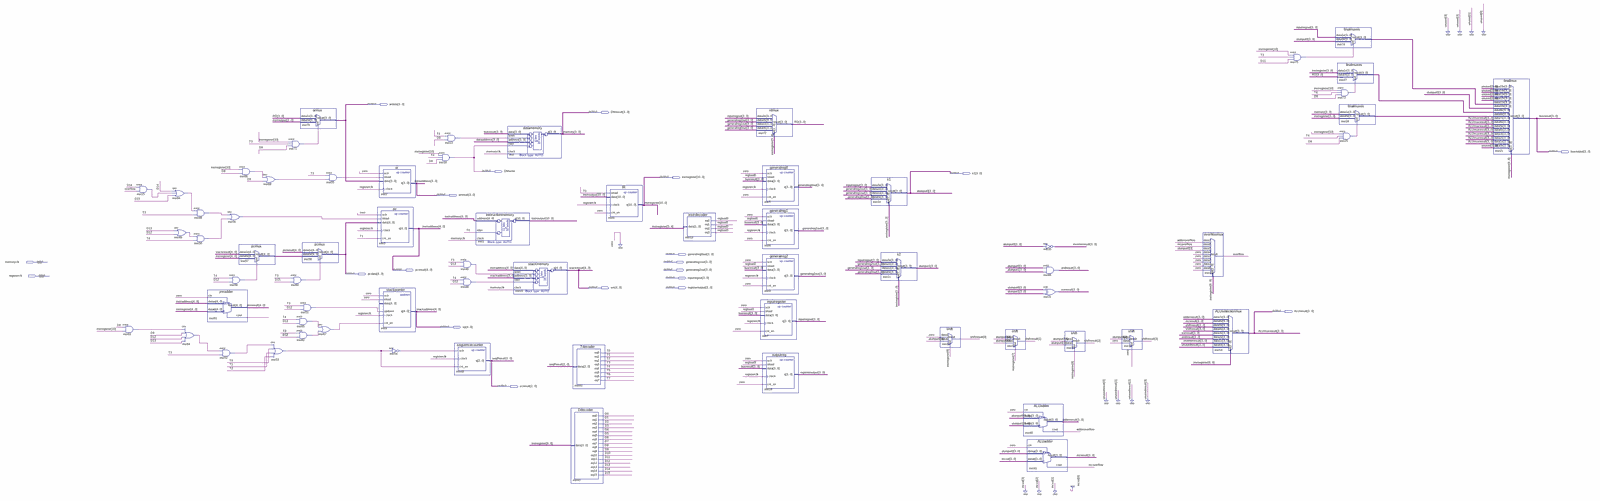
[diagram p0: schematic sheet, whole]
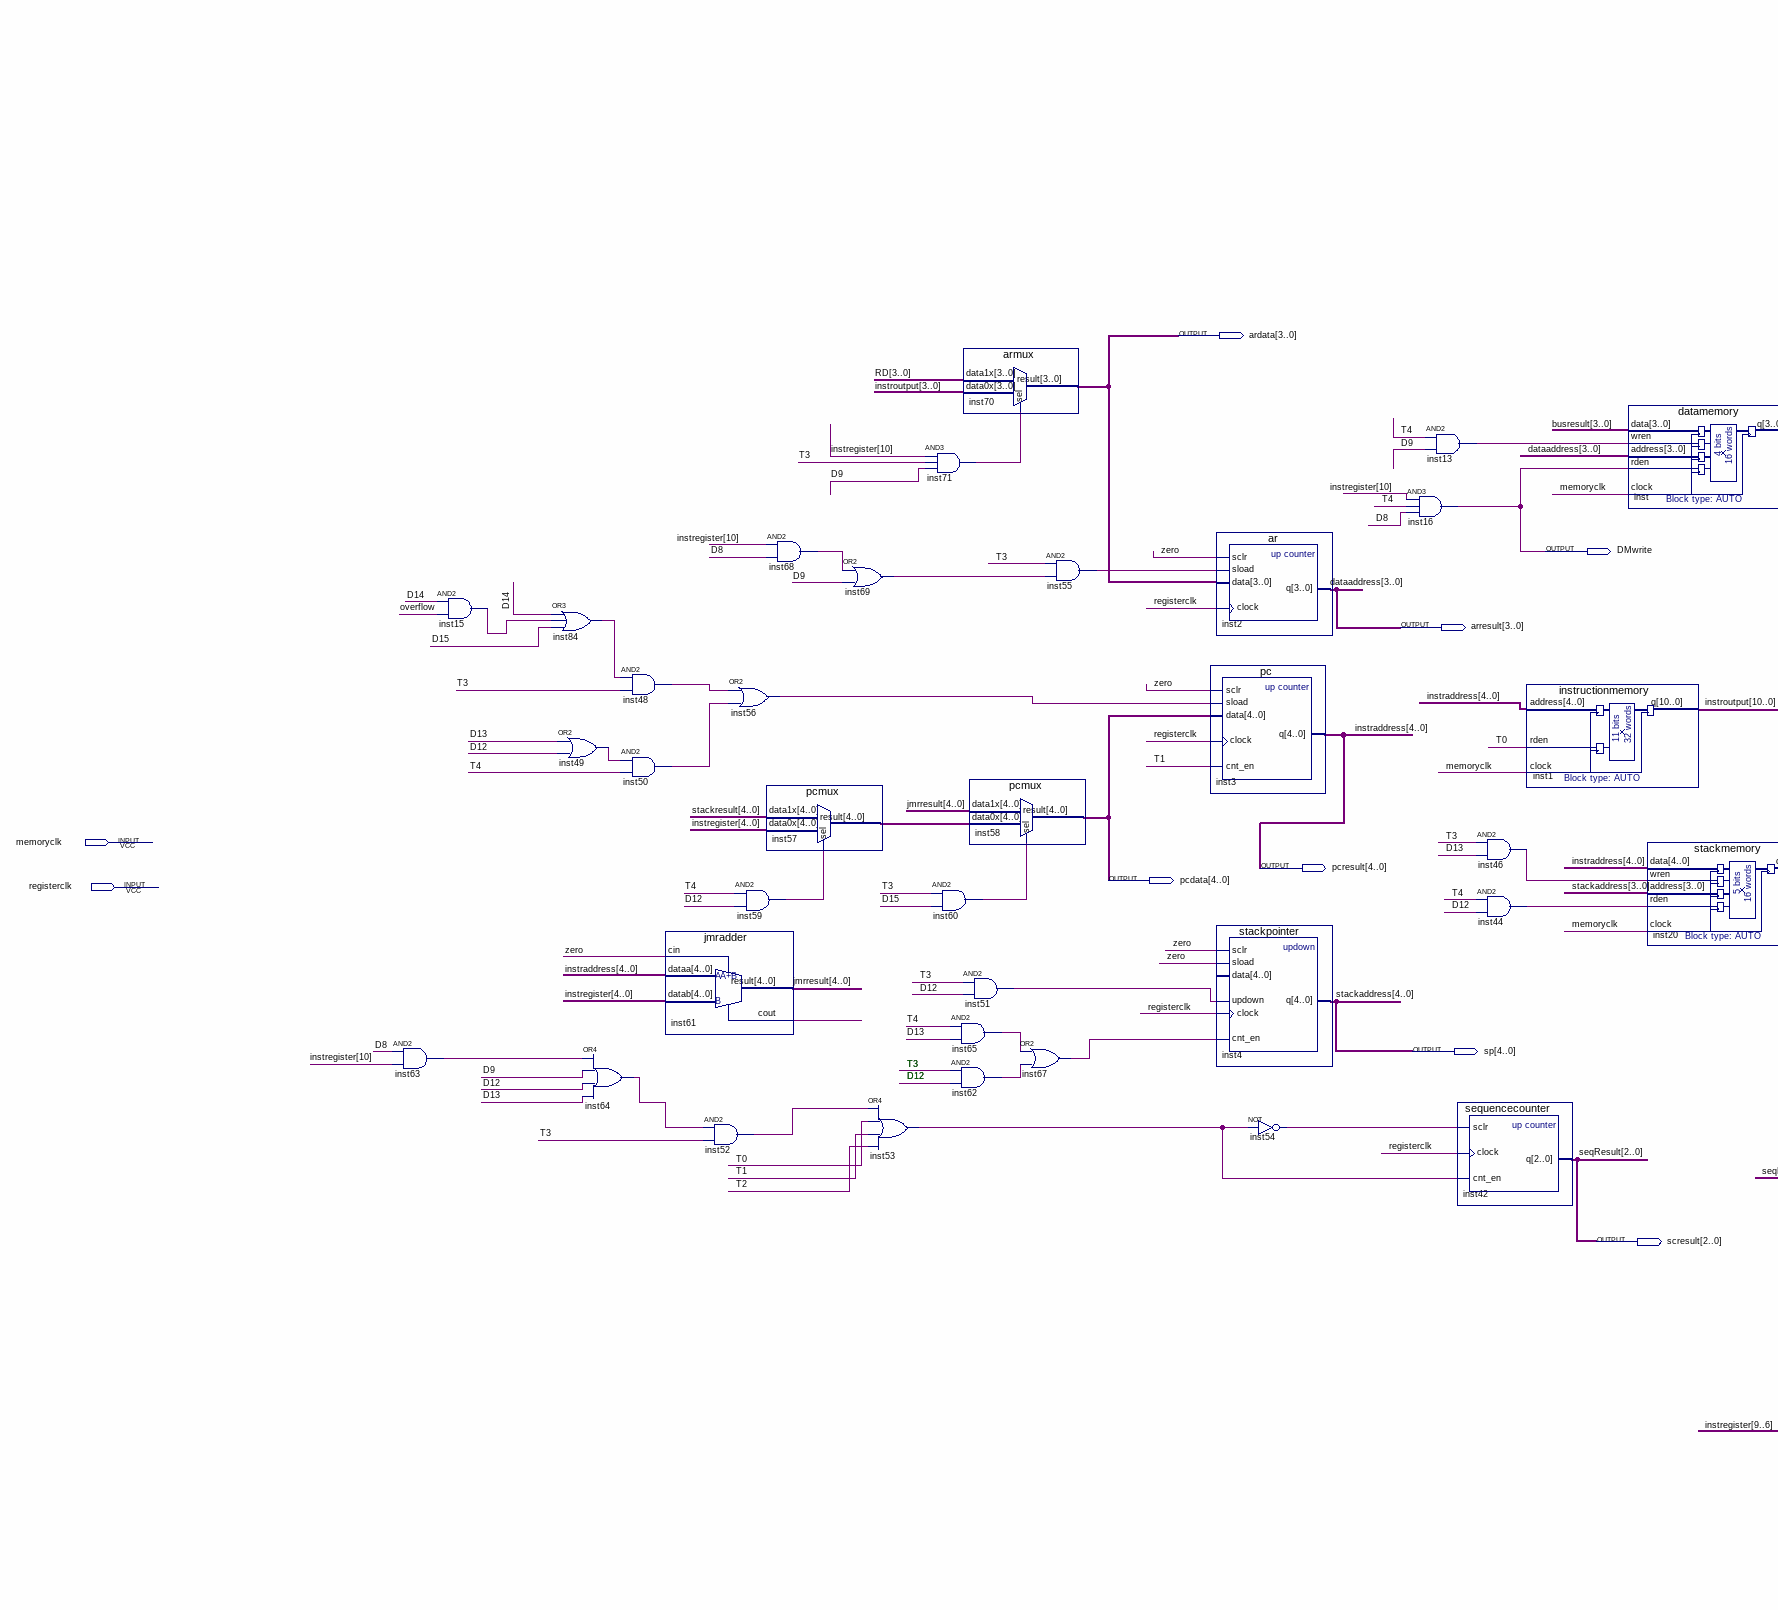
[diagram p1: schematic sheet, left part]
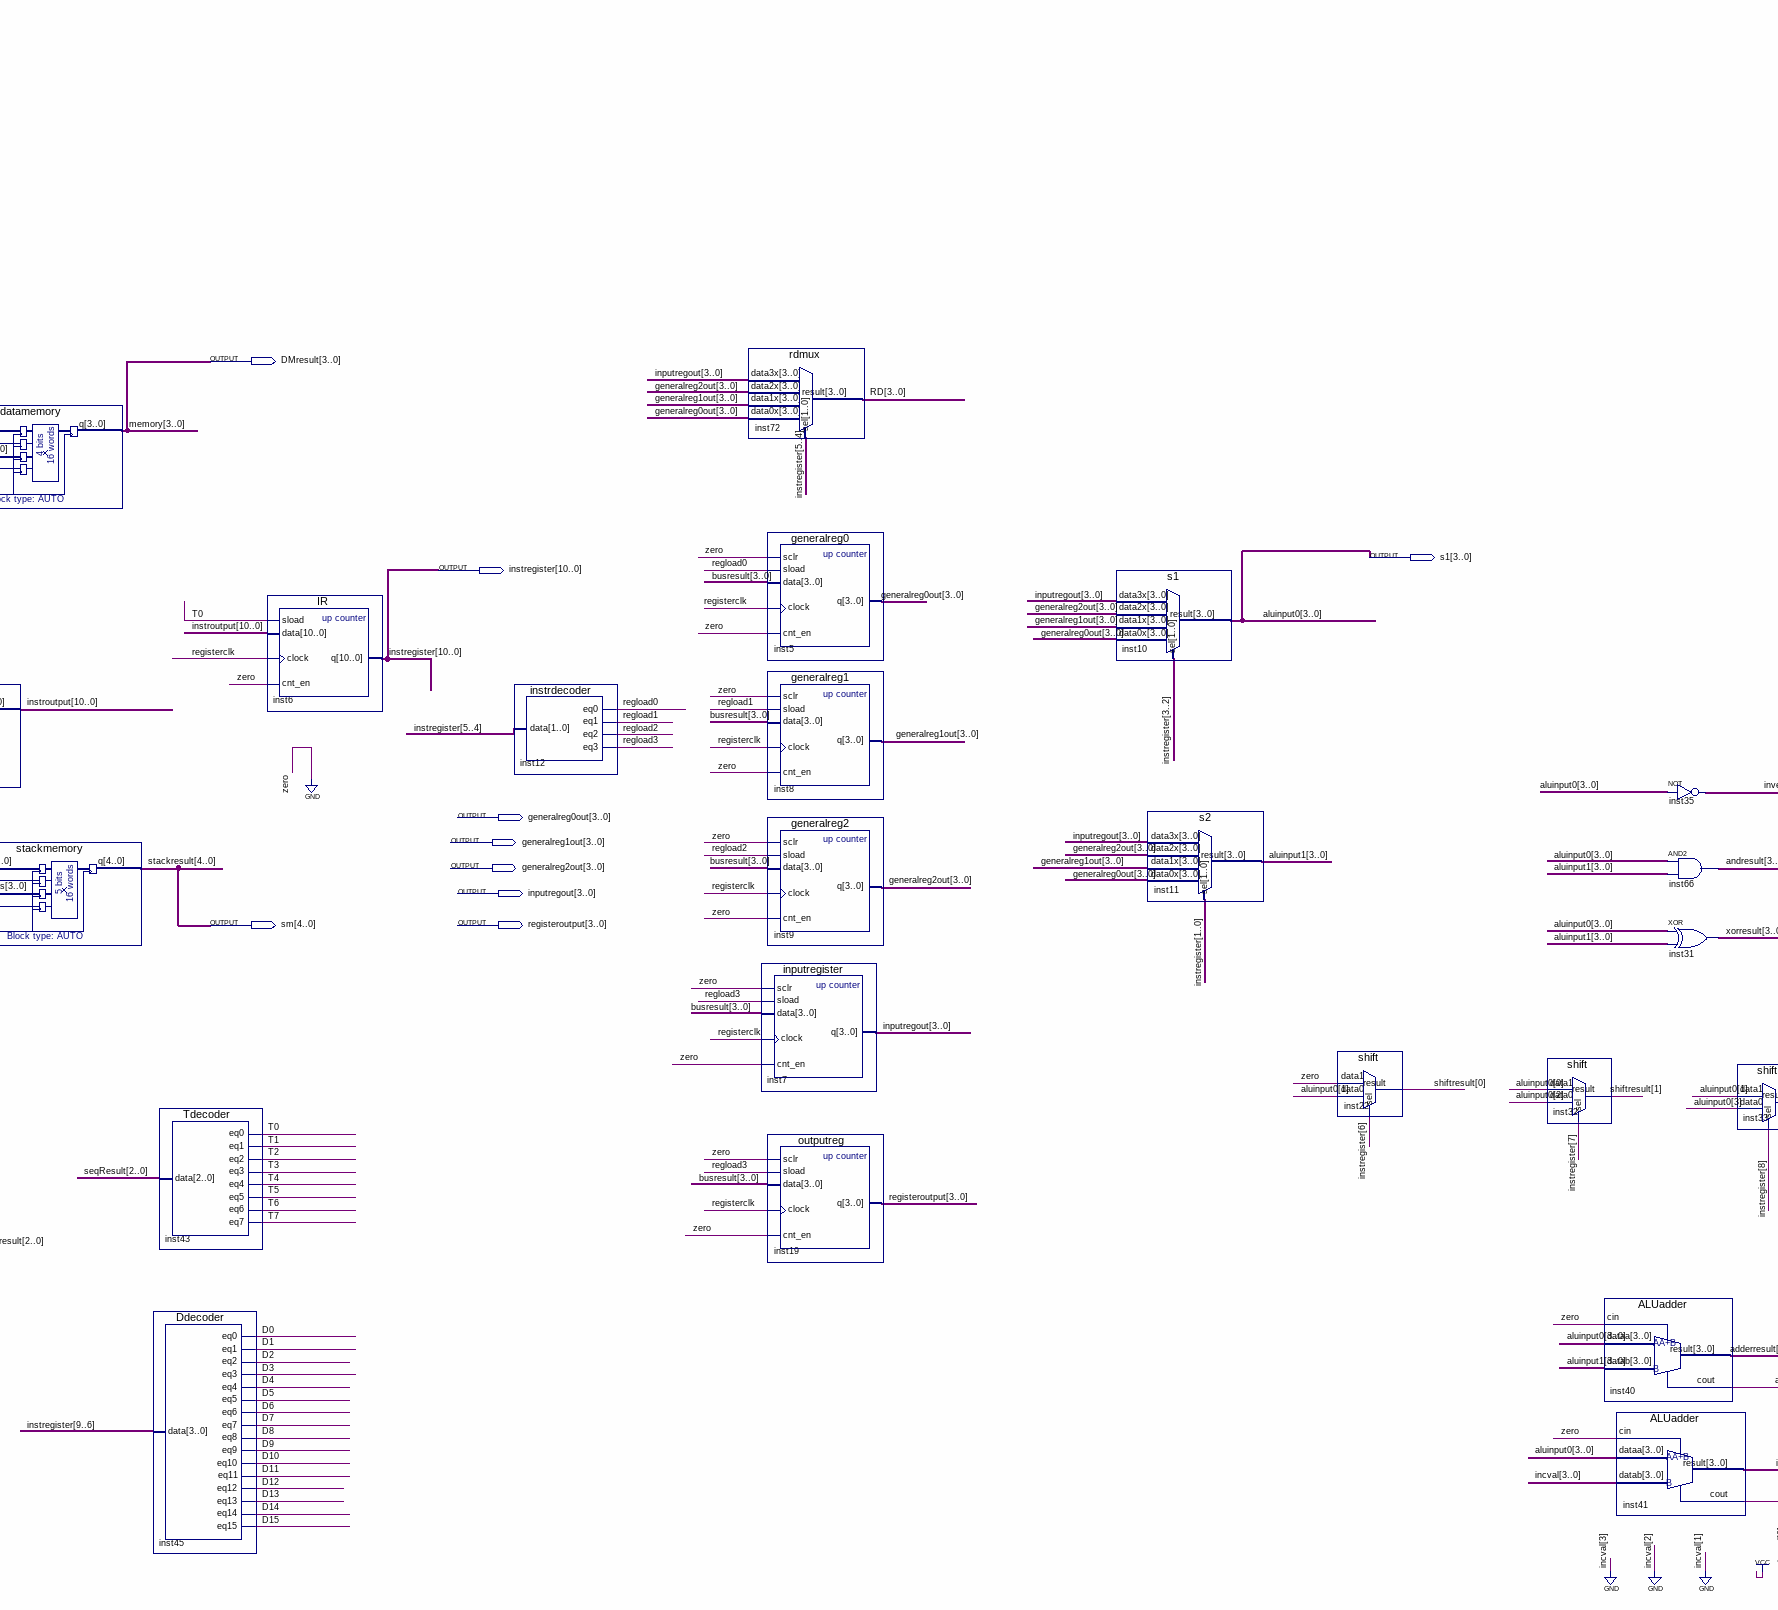
[diagram p2: schematic sheet, centre part]
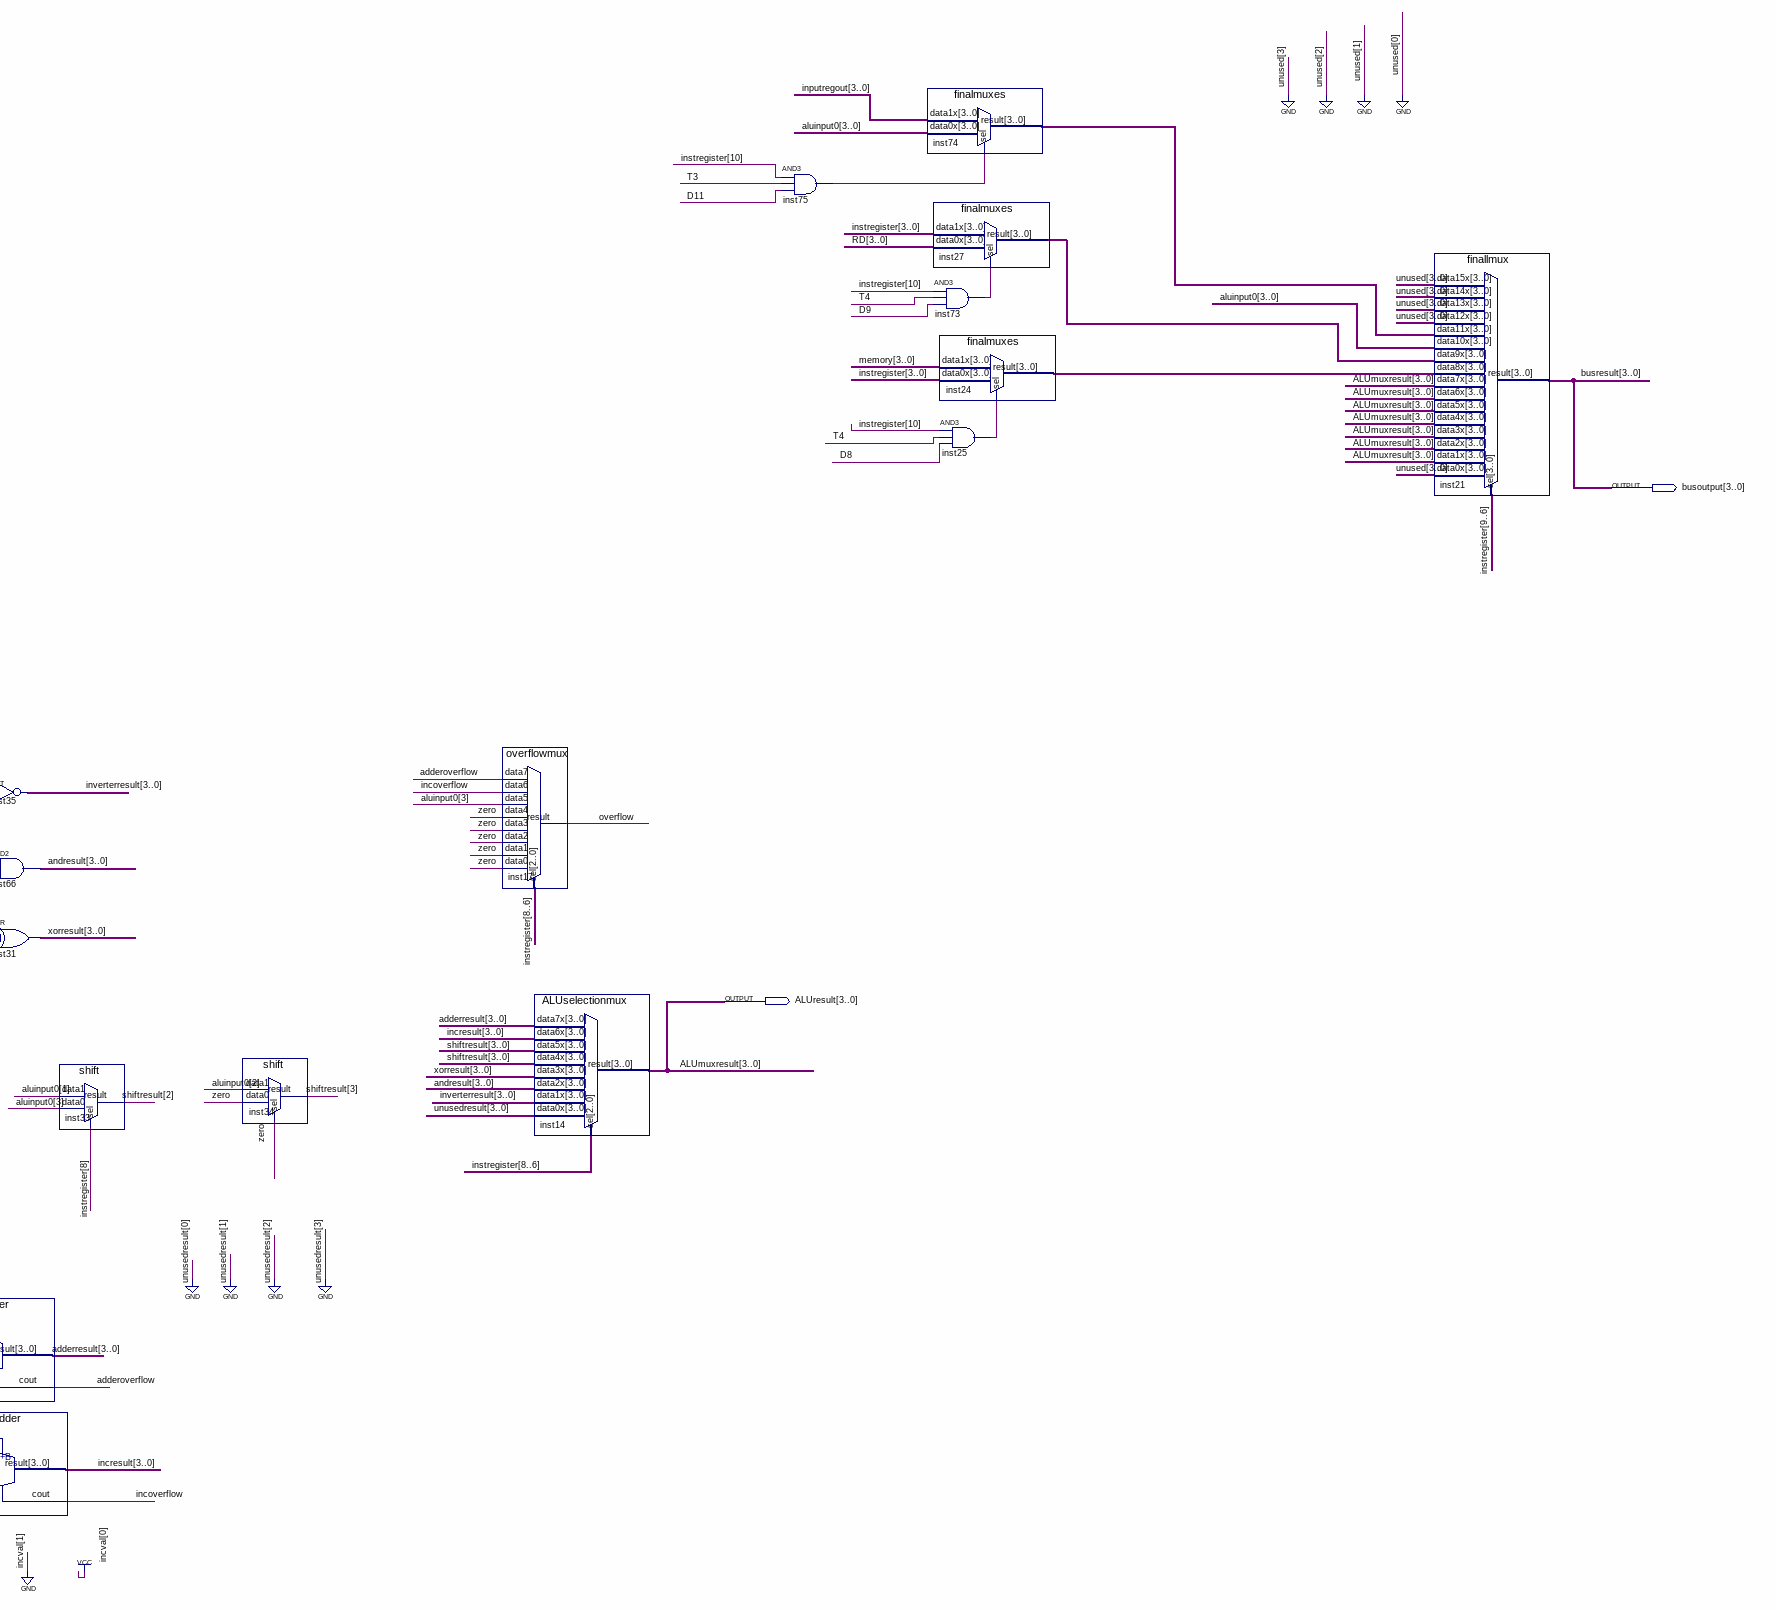
[diagram p3: schematic sheet, right part]
// Quartus schematic group32_hw8.bdf as structural Verilog: 66 symbols, 20 pins
module group32_hw8 (
  input  memoryclk,
  input  registerclk,
  output [3:0] ardata,
  output [3:0] DMresult,
  output [3:0] busoutput,
  output DMwrite,
  output [3:0] s1,
  output [10:0] instregister,
  output [3:0] arresult,
  output [3:0] generalreg0out,
  output [3:0] generalreg1out,
  output [4:0] pcresult,
  output [3:0] generalreg2out,
  output [4:0] pcdata,
  output [3:0] inputregout,
  output [4:0] sm,
  output [3:0] registeroutput,
  output [3:0] ALUresult,
  output [4:0] sp,
  output [2:0] scresult
);

  wire adderoverflow, D0, D1, D2, D3, D4, D5, D6, D7, D8, D9, D10, D11, D12, D13, D14, D15, incoverflow,
       inst13_out, inst15_out, inst25_out, inst44_out, inst46_out, inst48_out, inst49_out, inst50_out,
       inst51_out, inst52_out, inst53_out, inst54_out, inst55_out, inst56_out, inst59_out, inst60_out,
       inst61_cout, inst62_out, inst63_out, inst64_out, inst65_out, inst67_out, inst68_out, inst69_out,
       inst71_out, inst73_out, inst75_out, inst84_out, overflow, regload0, regload1, regload2, regload3, T0,
       T1, T2, T3, T4, T5, T6, T7;
  wire [3:0] adderresult, aluinput1, andresult, incresult, inst24_result, inst27_result, inst74_result,
       inverterresult, RD, shiftresult, xorresult;
  wire [4:0] inst57_result, jmrresult;
  wire [10:0] instroutput;

  and inst63 (inst63_out, D8, instregister[10]);
  and inst15 (inst15_out, D14, overflow);
  or inst84 (inst84_out, D14, inst15_out, D15);
  or inst49 (inst49_out, D13, D12);
  or inst64 (inst64_out, inst63_out, D9, D12, D13);
  and inst48 (inst48_out, inst84_out, T3);
  and inst50 (inst50_out, inst49_out, T4);
  jmradder inst61 (.cin(1'b0), .dataa(pcresult), .datab(instregister[4:0]), .result(jmrresult), .cout(inst61_cout));
  and inst52 (inst52_out, inst64_out, T3);
  or inst56 (inst56_out, inst48_out, inst50_out);
  and inst59 (inst59_out, T4, D12);
  and inst68 (inst68_out, instregister[10], D8);
  pcmux inst57 (.data1x(sm), .data0x(instregister[4:0]), .sel(inst59_out), .result(inst57_result));
  or inst69 (inst69_out, inst68_out, D9);
  or inst53 (inst53_out, inst52_out, T0, T1, T2);
  and inst71 (inst71_out, instregister[10], T3, D9);
  and inst60 (inst60_out, T3, D15);
  and inst65 (inst65_out, T4, D13);
  and inst62 (inst62_out, T3, D12);
  armux inst70 (.data1x(RD), .data0x(instroutput[3:0]), .sel(inst71_out), .result(ardata));
  pcmux inst58 (.data1x(jmrresult), .data0x(inst57_result), .sel(inst60_out), .result(pcdata));
  and inst51 (inst51_out, T3, D12);
  and inst55 (inst55_out, T3, inst69_out);
  or inst67 (inst67_out, inst65_out, inst62_out);
  pc inst3 (.sclr(1'b0), .sload(inst56_out), .data(pcdata), .clock(registerclk), .cnt_en(T1), .q(pcresult));
  ar inst2 (.sclr(1'b0), .sload(inst55_out), .data(ardata), .clock(registerclk), .q(arresult));
  stackpointer inst4 (
    .sclr(1'b0), .sload(1'b0), .updown(inst51_out), .clock(registerclk), .cnt_en(inst67_out), .q(sp));  // open: data
  not inst54 (inst54_out, inst53_out);
  and inst16 (DMwrite, instregister[10], T4, D8);
  and inst13 (inst13_out, T4, D9);
  sequencecounter inst42 (.sclr(inst54_out), .clock(registerclk), .cnt_en(inst53_out), .q(scresult));
  and inst46 (inst46_out, T3, D13);
  and inst44 (inst44_out, T4, D12);
  instructionmemory inst1 (.address(pcresult), .rden(T0), .clock(memoryclk), .q(instroutput));
  datamemory inst (
    .data(busoutput), .wren(inst13_out), .address(arresult), .rden(DMwrite), .clock(memoryclk), .q(DMresult));
  stackmemory inst20 (
    .data(pcresult), .wren(inst46_out), .address(sp[3:0]), .rden(inst44_out), .clock(memoryclk), .q(sm));
  Tdecoder inst43 (.data(scresult), .eq0(T0), .eq1(T1), .eq2(T2), .eq3(T3), .eq4(T4), .eq5(T5), .eq6(T6), .eq7(T7));
  Ddecoder inst45 (
    .data(instregister[9:6]), .eq0(D0), .eq1(D1), .eq2(D2), .eq3(D3), .eq4(D4), .eq5(D5), .eq6(D6), .eq7(D7),
    .eq8(D8), .eq9(D9), .eq10(D10), .eq11(D11), .eq12(D12), .eq13(D13), .eq14(D14), .eq15(D15));
  IR inst6 (.sload(T0), .data(instroutput), .clock(registerclk), .cnt_en(1'b0), .q(instregister));
  instrdecoder inst12 (.data(instregister[5:4]), .eq0(regload0), .eq1(regload1), .eq2(regload2), .eq3(regload3));
  rdmux inst72 (
    .data3x(inputregout), .data2x(generalreg2out), .data1x(generalreg1out), .data0x(generalreg0out),
    .sel(instregister[5:4]), .result(RD));
  generalreg0 inst5 (
    .sclr(1'b0), .sload(regload0), .data(busoutput), .clock(registerclk), .cnt_en(1'b0), .q(generalreg0out));
  generalreg1 inst8 (
    .sclr(1'b0), .sload(regload1), .data(busoutput), .clock(registerclk), .cnt_en(1'b0), .q(generalreg1out));
  generalreg2 inst9 (
    .sclr(1'b0), .sload(regload2), .data(busoutput), .clock(registerclk), .cnt_en(1'b0), .q(generalreg2out));
  inputregister inst7 (
    .sclr(1'b0), .sload(regload3), .data(busoutput), .clock(registerclk), .cnt_en(1'b0), .q(inputregout));
  outputreg inst19 (
    .sclr(1'b0), .sload(regload3), .data(busoutput), .clock(registerclk), .cnt_en(1'b0), .q(registeroutput));
  s1 inst10 (
    .data3x(inputregout), .data2x(generalreg2out), .data1x(generalreg1out), .data0x(generalreg0out),
    .sel(instregister[3:2]), .result(s1));
  s2 inst11 (
    .data3x(inputregout), .data2x(generalreg2out), .data1x(generalreg1out), .data0x(generalreg0out),
    .sel(instregister[1:0]), .result(aluinput1));
  shift inst22 (.data1(1'b0), .data0(s1[1]), .sel(instregister[6]), .result(shiftresult[0]));
  shift inst32 (.data1(s1[0]), .data0(s1[2]), .sel(instregister[7]), .result(shiftresult[1]));
  ALUadder inst40 (.cin(1'b0), .dataa(s1), .datab(aluinput1), .result(adderresult), .cout(adderoverflow));
  ALUadder inst41 (.cin(1'b0), .dataa(s1), .datab(4'b0001), .result(incresult), .cout(incoverflow));
  assign inverterresult = ~s1;  // NOT inst35, 4 bits wide
  assign andresult = s1 & aluinput1;  // AND2 inst66, 4 bits wide
  assign xorresult = s1 ^ aluinput1;  // XOR inst31, 4 bits wide
  shift inst33 (.data1(s1[1]), .data0(s1[3]), .sel(instregister[8]), .result(shiftresult[2]));
  shift inst34 (.data1(s1[2]), .data0(1'b0), .sel(1'b0), .result(shiftresult[3]));
  overflowmux inst17 (
    .data7(adderoverflow), .data6(incoverflow), .data5(s1[3]), .data4(1'b0), .data3(1'b0), .data2(1'b0),
    .data1(1'b0), .data0(1'b0), .sel(instregister[8:6]), .result(overflow));
  ALUselectionmux inst14 (
    .data7x(adderresult), .data6x(incresult), .data5x(shiftresult), .data4x(shiftresult), .data3x(xorresult),
    .data2x(andresult), .data1x(inverterresult), .data0x(4'b0000), .sel(instregister[8:6]), .result(ALUresult));
  and inst75 (inst75_out, instregister[10], T3, D11);
  finalmuxes inst74 (.data1x(inputregout), .data0x(s1), .sel(inst75_out), .result(inst74_result));
  finalmuxes inst27 (.data1x(instregister[3:0]), .data0x(RD), .sel(inst73_out), .result(inst27_result));
  and inst73 (inst73_out, instregister[10], T4, D9);
  finalmuxes inst24 (.data1x(DMresult), .data0x(instregister[3:0]), .sel(inst25_out), .result(inst24_result));
  and inst25 (inst25_out, instregister[10], T4, D8);
  finallmux inst21 (
    .data15x(4'b0000), .data14x(4'b0000), .data13x(4'b0000), .data12x(4'b0000), .data11x(inst74_result),
    .data10x(s1), .data9x(inst27_result), .data8x(inst24_result), .data7x(ALUresult), .data6x(ALUresult),
    .data5x(ALUresult), .data4x(ALUresult), .data3x(ALUresult), .data2x(ALUresult), .data1x(ALUresult),
    .data0x(4'b0000), .sel(instregister[9:6]), .result(busoutput));

  // Other names for the same wires on the sheet: ALUmuxresult[3:0] = ALUresult; dataaddress[3:0] = arresult;
  //   busresult[3:0] = busoutput; memory[3:0] = DMresult; instraddress[4:0] = pcresult; aluinput0[3:0] = s1;
  //   seqResult[2:0] = scresult; stackresult[4:0] = sm; stackaddress[4:0] = sp

  // Notes on the sheet:
  //   T3
  //   D12
endmodule
